# Altium schematic sheet Gate.SchDoc
size A4; SheetNumber: 3; SheetTotal: 6
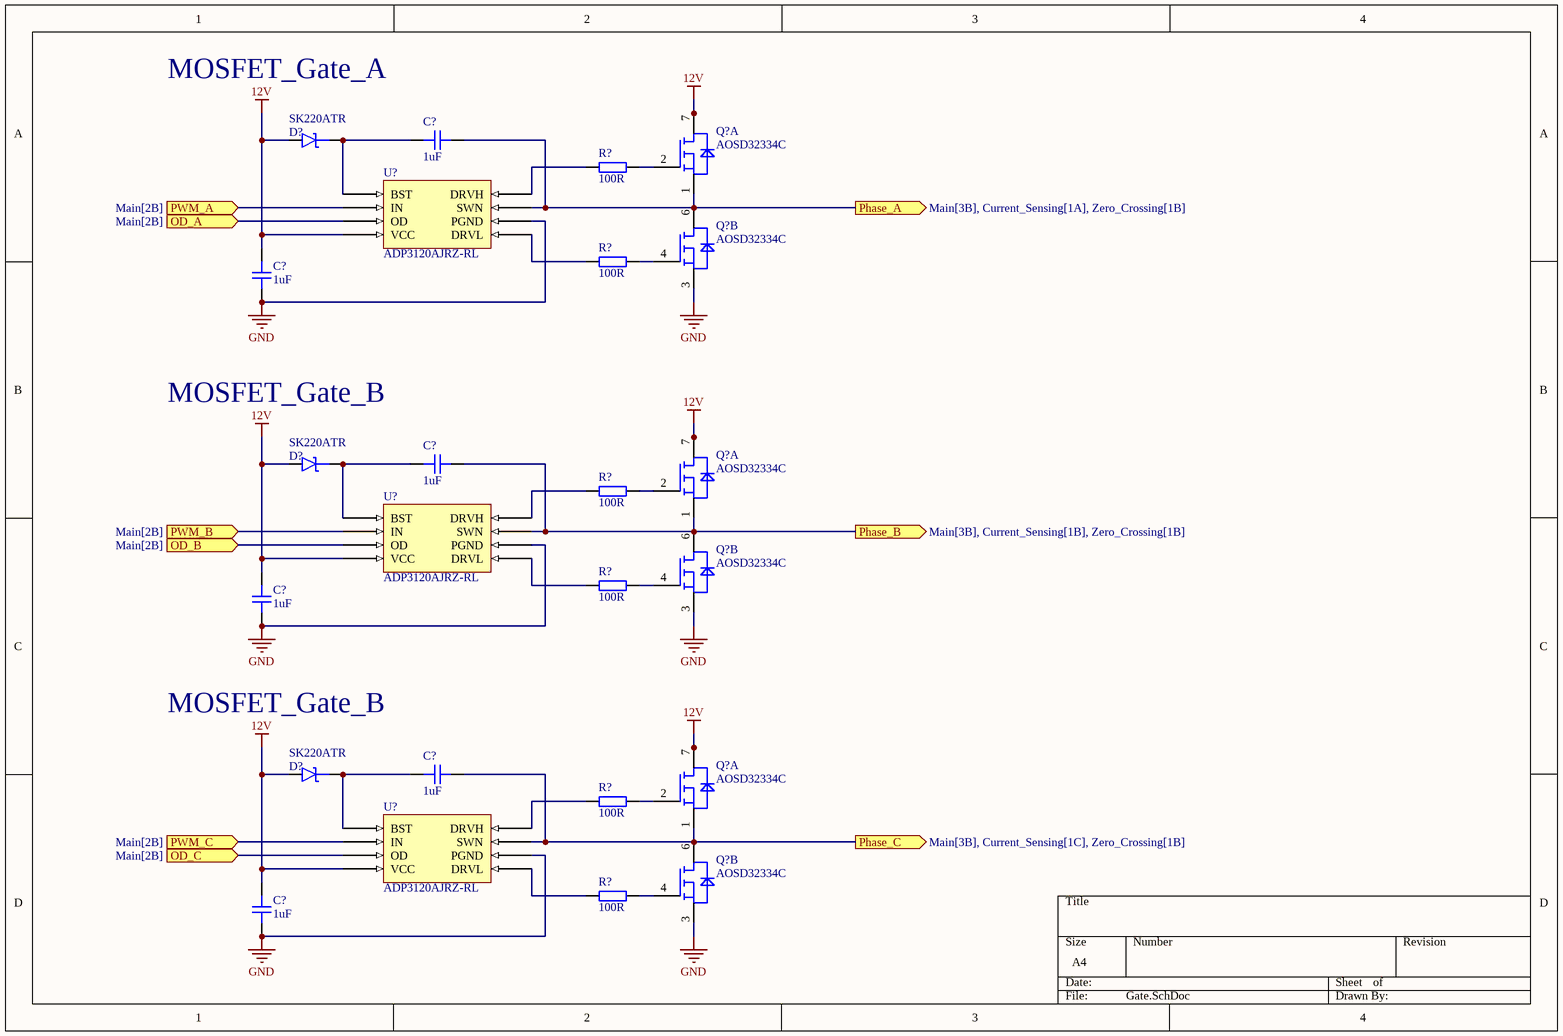
[diagram p0: Gate.SchDoc]

## Parts
(Parts that share a designator on the sheet are numbered #1, #2 ... from top to bottom, then left to right.)
C?#1  1uF  [CAP_0402]
C?#2  1uF  [CAP_0402]
C?#3  1uF  [CAP_0402]
C?#4  1uF  [CAP_0402]
C?#5  1uF  [CAP_0402]
C?#6  1uF  [CAP_0402]
D?#1  SK220ATR  [DO-214AC-2 (SMA)]
D?#2  SK220ATR  [DO-214AC-2 (SMA)]
D?#3  SK220ATR  [DO-214AC-2 (SMA)]
Q?#1  AOSD32334C  [SOIC-8]  (part A of 2)
Q?#2  AOSD32334C  [SOIC-8]  (part B of 2)
Q?#3  AOSD32334C  [SOIC-8]  (part A of 2)
Q?#4  AOSD32334C  [SOIC-8]  (part B of 2)
Q?#5  AOSD32334C  [SOIC-8]  (part A of 2)
Q?#6  AOSD32334C  [SOIC-8]  (part B of 2)
R?#1  100R  [RES_0402]
R?#2  100R  [RES_0402]
R?#3  100R  [RES_0402]
R?#4  100R  [RES_0402]
R?#5  100R  [RES_0402]
R?#6  100R  [RES_0402]
U?#1  ADP3120AJRZ-RL  [SOIC127P600X175-8N]
U?#2  ADP3120AJRZ-RL  [SOIC127P600X175-8N]
U?#3  ADP3120AJRZ-RL  [SOIC127P600X175-8N]

## Ports
OD_A (in, see Main[2B]), OD_B (in, see Main[2B]), OD_C (in, see Main[2B]), Phase_A (out, see Main[3B], Current_Sensing[1A], Zero_Crossing[1B]), Phase_B (out, see Main[3B], Current_Sensing[1B], Zero_Crossing[1B]), Phase_C (out, see Main[3B], Current_Sensing[1C], Zero_Crossing[1B]), PWM_A (in, see Main[2B]), PWM_B (in, see Main[2B]), PWM_C (in, see Main[2B])

## Nets
12V: C?#2.2 C?#4.2 C?#6.2 D?#1.A D?#2.A D?#3.A Q?#1.7 Q?#1.8 Q?#3.7 Q?#3.8 Q?#5.7 Q?#5.8 U?#1.4(VCC) U?#2.4(VCC) U?#3.4(VCC)
GND: C?#2.1 C?#4.1 C?#6.1 Q?#2.3 Q?#4.3 Q?#6.3 U?#1.6(PGND) U?#2.6(PGND) U?#3.6(PGND)
OD_A: U?#1.3(OD) ; port OD_A
OD_B: U?#2.3(OD) ; port OD_B
OD_C: U?#3.3(OD) ; port OD_C
Phase_A: C?#1.1 Q?#1.1 Q?#2.5 Q?#2.6 U?#1.7(SWN) ; port Phase_A
Phase_B: C?#3.1 Q?#3.1 Q?#4.5 Q?#4.6 U?#2.7(SWN) ; port Phase_B
Phase_C: C?#5.1 Q?#5.1 Q?#6.5 Q?#6.6 U?#3.7(SWN) ; port Phase_C
PWM_A: U?#1.2(IN) ; port PWM_A
PWM_B: U?#2.2(IN) ; port PWM_B
PWM_C: U?#3.2(IN) ; port PWM_C
NetC?#1_2: C?#1.2 D?#1.K U?#1.1(BST)
NetC?#3_2: C?#3.2 D?#2.K U?#2.1(BST)
NetC?#5_2: C?#5.2 D?#3.K U?#3.1(BST)
NetQ?#1_2: Q?#1.2 R?#1.2
NetQ?#2_4: Q?#2.4 R?#2.2
NetQ?#3_2: Q?#3.2 R?#3.2
NetQ?#4_4: Q?#4.4 R?#4.2
NetQ?#5_2: Q?#5.2 R?#5.2
NetQ?#6_4: Q?#6.4 R?#6.2
NetR?#1_1: R?#1.1 U?#1.8(DRVH)
NetR?#2_1: R?#2.1 U?#1.5(DRVL)
NetR?#3_1: R?#3.1 U?#2.8(DRVH)
NetR?#4_1: R?#4.1 U?#2.5(DRVL)
NetR?#5_1: R?#5.1 U?#3.8(DRVH)
NetR?#6_1: R?#6.1 U?#3.5(DRVL)

## Notes on the sheet
- MOSFET_Gate_A
- MOSFET_Gate_B

## Library data of the parts
C?#1-C?#6 = CAP_0402: Capacitor SMD 0402; Manufacturer: *; Manufacturer Part Number: *; Distributor Link: *; LCSC: *; Rating: *; Dielectric: *
D?#1-D?#3 = D_SCHOTTKY_SMA: Diode Schottky SMD SMA (DO-214AA)
R?#1-R?#6 = RES_0402: Resistor SMD 0402; Manufacturer: *; Manufacturer Part Number: *; Distributor Link: *; LCSC: *
U?#1-U?#3 = CMP-00000-1: Half Bridge Based MOSFET Driver, PDSO8; Turn-On Delay Time: 0.045us; Channels: 1; Turn-Off Delay Time: 0.07us; Qualification Status: Not Qualified; Power Supplies: 12V; Min Supply Voltage: 4.6V; Package Body Material: Plastic; Package Equivalence Code: SOP8,.25; Time @ Peak Reflow Temperature-Max (s): 40s; High Side Driver: Yes; Max Supply Voltage: 13.2V; Case/Package: SOP; Peak Reflow Temperature (Cel): 260°C; Terminal Pitch: 1.27mm; JESD-609 Code: e3; Surface Mount: Yes; Temperature Grade: OTHER; Pins: 8; Reach SVHC Compliant: Yes; RoHS Compliant: Yes; Nominal Supply Voltage: 12V; Width: 3.9mm; JESD-30 Code: R-PDSO-G8; Package Style: SMALL OUTLINEMeter; Terminal Finish: Tin; Length: 4.9mm; Height - Seated (Max): 1.75mm; Min Operating Temperature: 0°C; Max Operating Temperature: 85°C; Terminal Position: DUAL; Interface IC Type: HALF BRIDGE BASED MOSFET DRIVER; Terminal Form: Gull Wing; Moisture Sensitivity Level: 1; Package Shape: Rectangular